# EAGLE board leitorcartao (EAGLE 6.3)
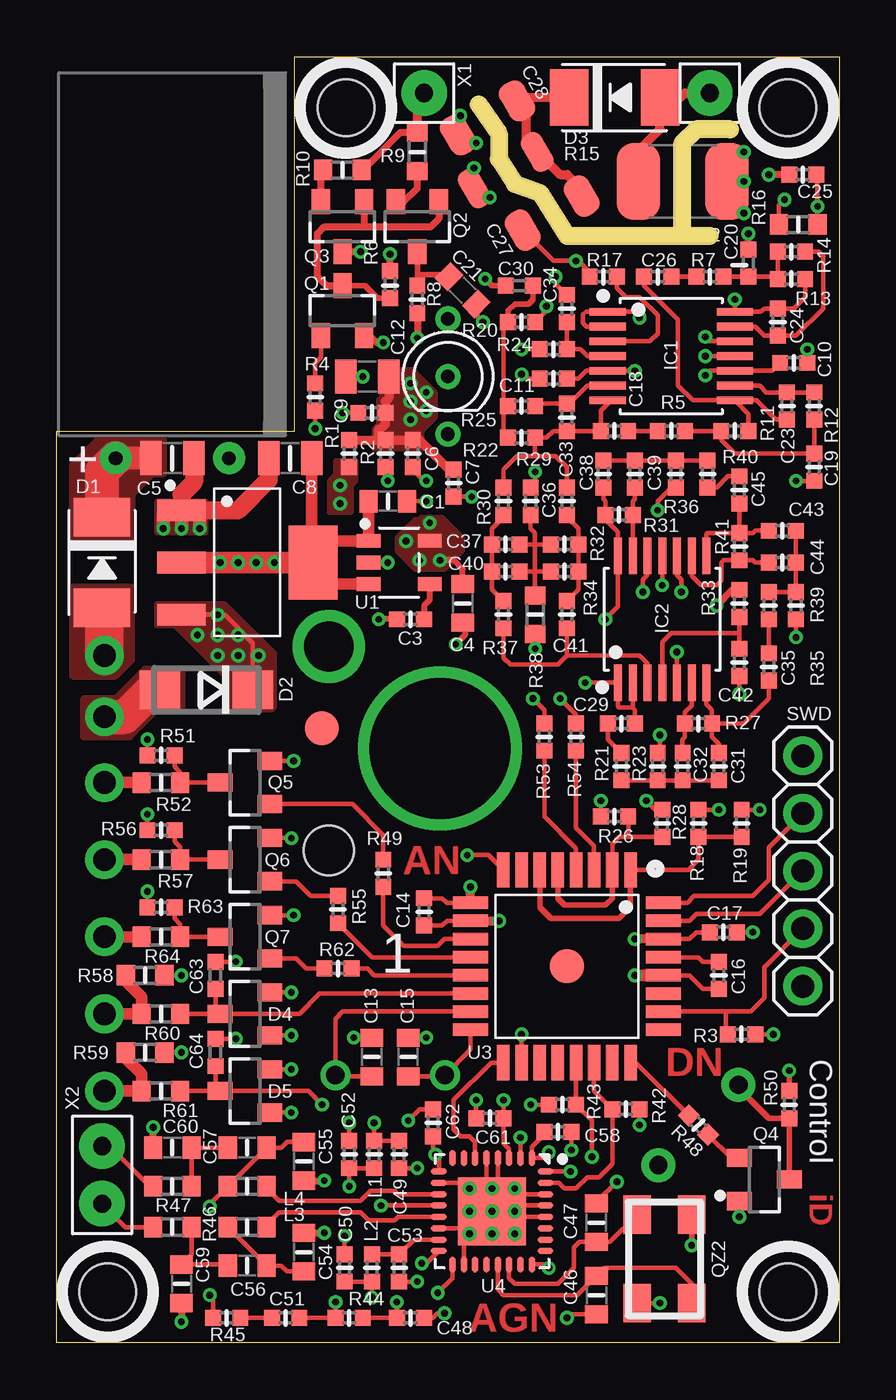
[diagram p5: board, top side]
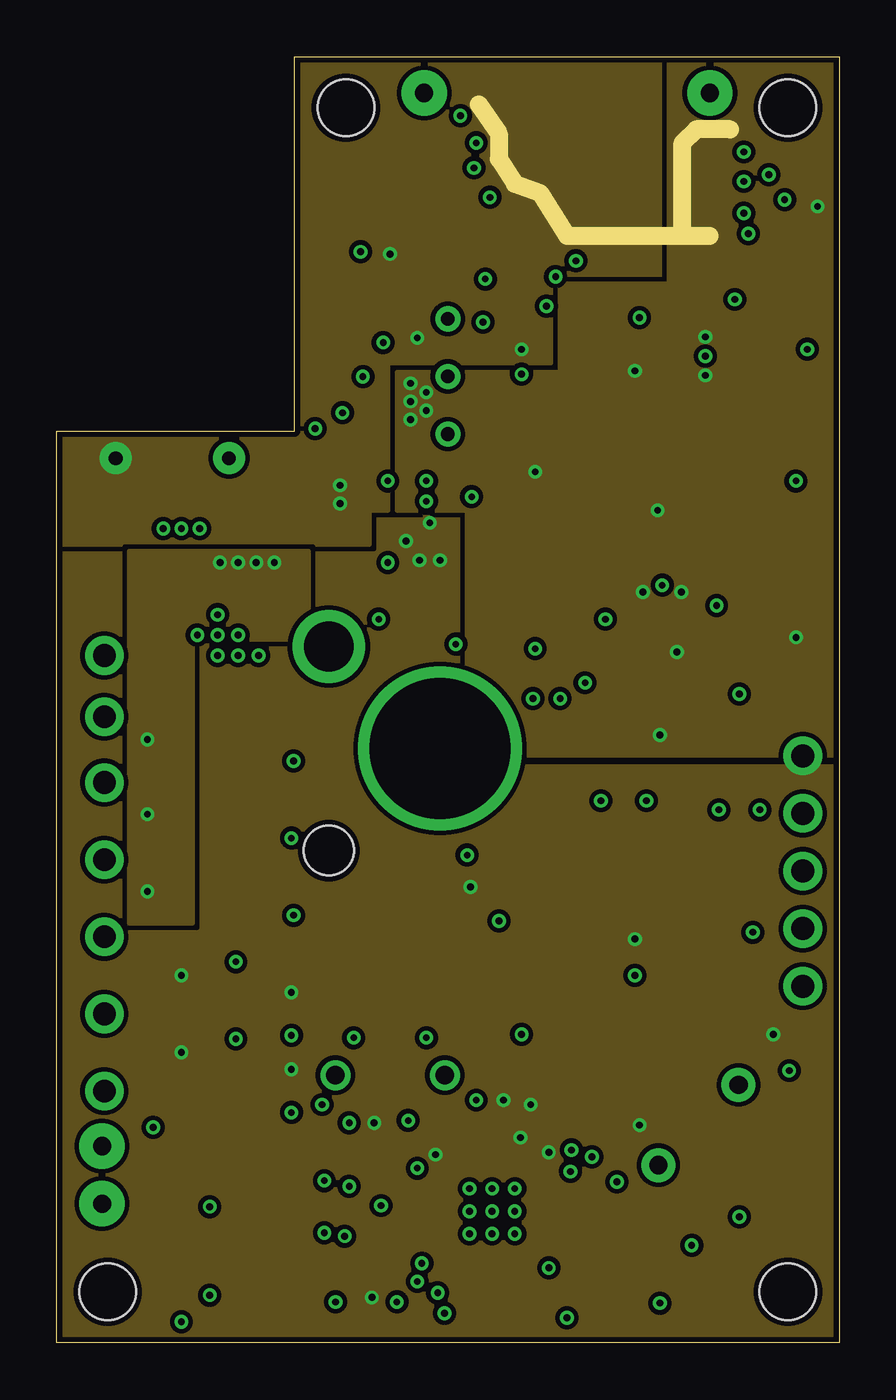
[diagram p6: board, inner layer Route4]
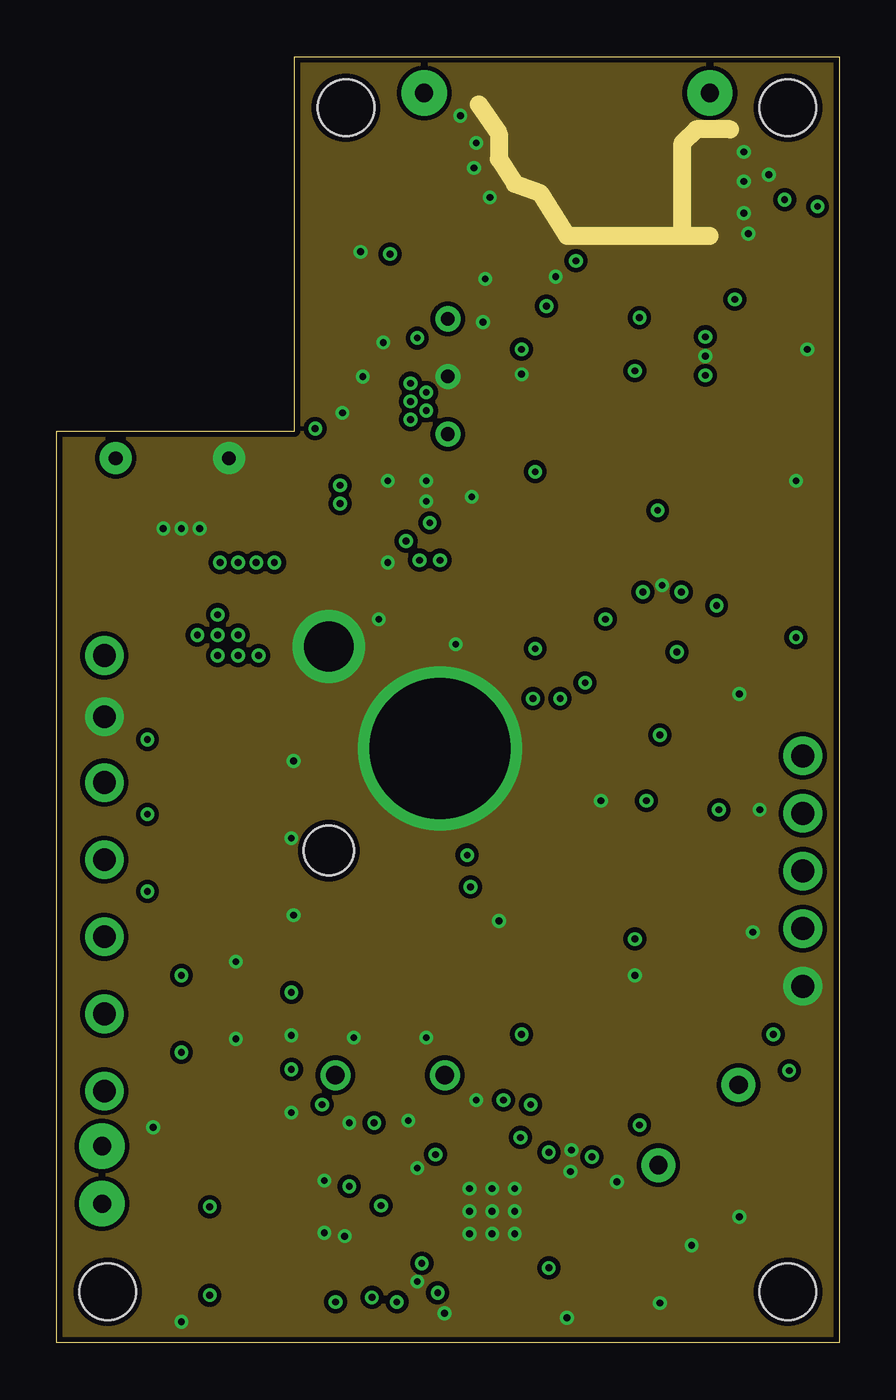
[diagram p7: board, inner layer Route5]
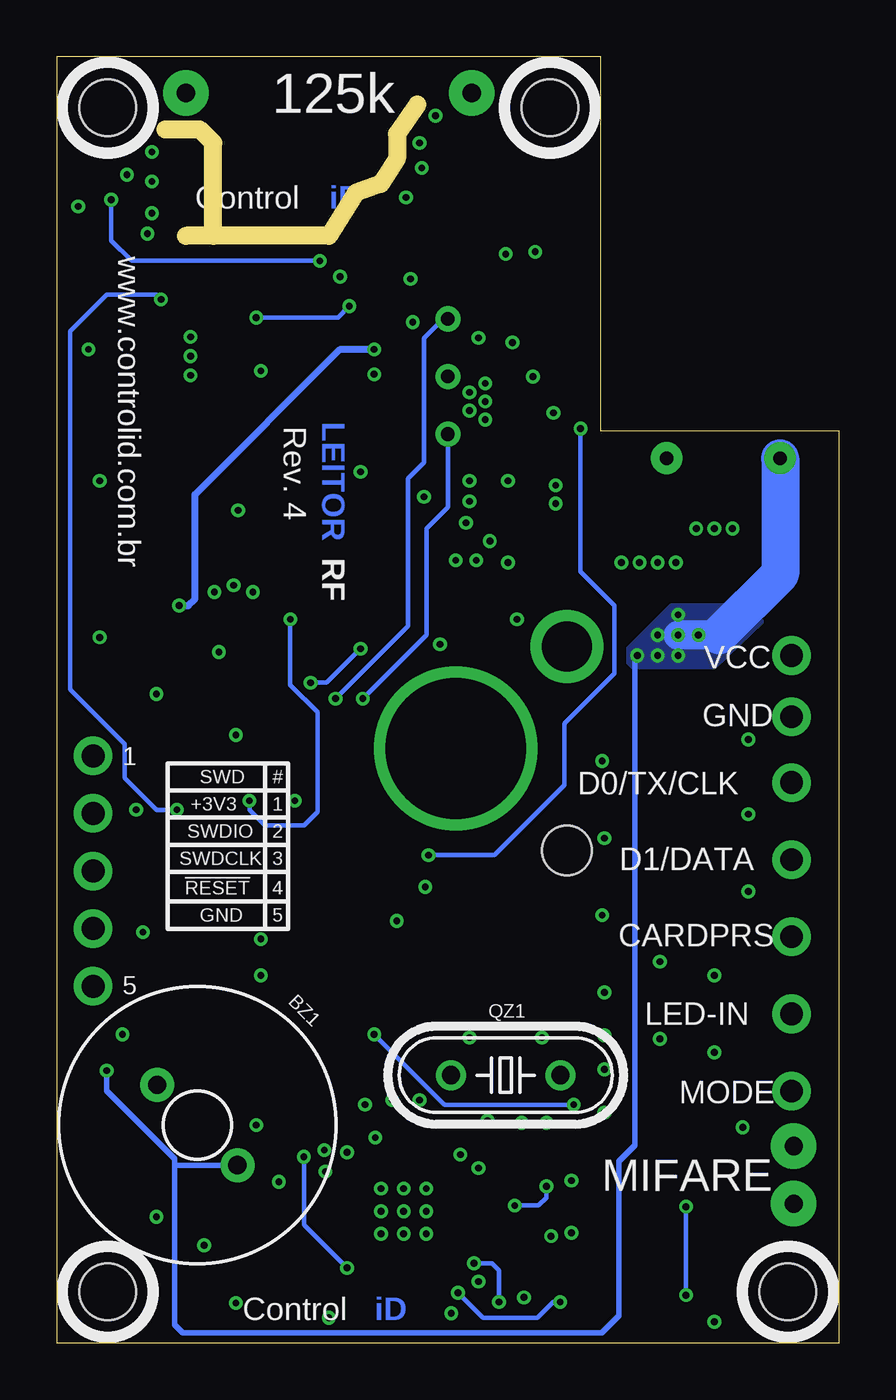
[diagram p8: board, bottom side, seen from below]

Size 34.5 x 56.7 mm. Coordinates in mm from the lower left corner, seen from the top.
Outline: 10.5,56.7 34.5,56.7 34.5,0 0,0 0,40.2 10.5,40.2 10.5,56.7
Copper layers (1+4*5+16): Top 0.035mm / dielectric 0.2mm / Route4 0.035mm / dielectric 1.1mm / Route5 0.035mm / dielectric 0.2mm / Bottom 0.035mm
Design rules "LeitorDRC": minimum track width 8mil, minimum drill 0.3mm, track to track 8mil, track to pad 8mil, pad to pad 8mil, via to via 8mil, smd to smd 0mil, copper to edge 10mil, drill to drill 10mil, minimum pad ring 10mil, minimum via ring 6mil, stop-mask expansion 2mil, vias tented up to drill 100mil, thermal gap 10mil
Holes 2.2 mm at 12,21.7
Holes 2.5 mm at 2.25,2.25 32.25,2.25 12.75,54.45 32.25,54.45
bRestrict: area 17.9,53.9 to 18.2,56.5; area 29.9,32.2 to 34.4,32.4
Milling: 10 lines

## Footprints (pad centres in the part's own frame; a part is rotated, then mirrored left to right if it is on the bottom)
F/TMB = drill 0.8 pad 1.5: + 2.5,0; - -2.5,0
C0603 = smd 0.8 x 1: 1 -0.85,0; 2 0.85,0
ESK108M016AH2AA = drill 0.6 pad 1.4: + -2.5,0; - 2.5,0
C0402 = smd 0.7 x 0.7: 1 -0.6,0; 2 0.6,0
C0805 = smd 0.95 x 1.5: 1 -0.95,0; 2 0.95,0
C1812S = smd 1.9 x 3.4: 1 -1.95,0; 2 1.95,0
C1206S = smd 1.2 x 1.8: 1 -1.5,0; 2 1.5,0
HOLE = drill 1 pad 1.7: P$1 0,0
SMA = smd 1.7 x 2.5: A 2,0; K -2,0
DO214AC = smd 1.8 x 1.7: A 2.05,0; C -2.05,0
SOT23 = smd 0.8 x 1.1: 1 -0.95,-1.1; 2 0.95,-1.1; 3 0,1.1
FIDUCIAL-1.5X3 = smd 1.5 x 1.5: 1 0,0
TSSOP14 = smd 0.35 x 1.6: 1 -1.95,-2.8; 2 -1.3,-2.8; 3 -0.65,-2.8; 4 0,-2.8; 5 0.65,-2.8; 6 1.3,-2.8; 7 1.95,-2.8; 8 1.95,2.8; 9 1.3,2.8; 10 0.65,2.8; 11 0,2.8; 12 -0.65,2.8; 13 -1.3,2.8; 14 -1.95,2.8
R0402 = smd 0.7 x 0.7: 1 -0.6,0; 2 0.6,0
R0603 = smd 0.8 x 0.9: 1 -0.85,0; 2 0.85,0
LTL1BEKVJNN = drill 0.6: ANODE_GRN -2.54,0; ANODE_RED 2.54,0; COMMON 0,0
HC49/S = drill 0.813: 1 -2.413,0; 2 2.413,0
CRISTAL4SMD = smd 1.7 x 1.2: 1 -1.95,-1.2; 2 1.95,-1.2; 3 1.95,1.2; 4 -1.95,1.2
R1206S = smd 1 x 1.8: 1 -1.6,0; 2 1.6,0
1X05 = drill 1.016 pad 1.7: 1 -5.08,0; 2 -2.54,0; 3 0,0; 4 2.54,0; 5 5.08,0
SOT-23-5 = smd 0.6 x 1.05: 1 -0.95,-1.35; 2 0,-1.35; 3 0.95,-1.35; 4 0.95,1.35; 5 -0.95,1.35
SOT223-3L = smd 0.95 x 2.15: 1 -2.3,-2.9; 2 0,-2.9; 3 2.3,-2.9 | smd 3.25 x 2.15: 4 0,2.9
TQFP32 = smd 0.55 x 1.55: 1 -2.8,-4.25; 2 -2,-4.25; 3 -1.2,-4.25; 4 -0.4,-4.25; 5 0.4,-4.25; 6 1.2,-4.25; 7 2,-4.25; 8 2.8,-4.25; 17 2.8,4.25; 18 2,4.25; 19 1.2,4.25; 20 0.4,4.25; 21 -0.4,4.25; 22 -1.2,4.25; 23 -2,4.25; 24 -2.8,4.25 | smd 1.55 x 0.55: 9 4.25,-2.8; 10 4.25,-2; 11 4.25,-1.2; 12 4.25,-0.4; 13 4.25,0.4; 14 4.25,1.2; 15 4.25,2; 16 4.25,2.8; 25 -4.25,2.8; 26 -4.25,2; 27 -4.25,1.2; 28 -4.25,0.4; 29 -4.25,-0.4; 30 -4.25,-1.2; 31 -4.25,-2; 32 -4.25,-2.8
QFN32 = smd 0.69 x 0.28: 1 -2.35,1.75; 2 -2.35,1.25; 3 -2.35,0.75; 4 -2.35,0.25; 5 -2.35,-0.25; 6 -2.35,-0.75; 7 -2.35,-1.25; 8 -2.35,-1.75; 17 2.35,-1.75; 18 2.35,-1.25; 19 2.35,-0.75; 20 2.35,-0.25; 21 2.35,0.25; 22 2.35,0.75; 23 2.35,1.25; 24 2.35,1.75 | smd 0.28 x 0.69: 9 -1.75,-2.35; 10 -1.25,-2.35; 11 -0.75,-2.35; 12 -0.25,-2.35; 13 0.25,-2.35; 14 0.75,-2.35; 15 1.25,-2.35; 16 1.75,-2.35; 25 1.75,2.35; 26 1.25,2.35; 27 0.75,2.35; 28 0.25,2.35; 29 -0.25,2.35; 30 -0.75,2.35; 31 -1.25,2.35; 32 -1.75,2.35 | smd 3 x 3: 33 0,0
22-23-2021 = drill 0.8 pad 2: 1 -6.3,0; 2 6.3,0
ANTENNA = drill 0.8 pad 2: 1 -1.27,0; 2 1.27,0

## Placement (x,y rotation side)
BZ1  F/TMB  [F/TMB]  28.3,9.6 315 bottom
C1  4.7u  [C0603]  14.6,37.1 0 top
C2  ESK108M016AH2AA  [ESK108M016AH2AA]  5.1,39 0 top
C3  10n  [C0402]  15.6,31.9 180 top
C4  4.7u  [C0603]  17.9,32.6 270 top
C5  10u  [C0805]  5.1,39 0 top
C6  0.1u  [C0402]  15.7,39.2 270 top
C7  10n  [C0402]  17.5,37.9 270 top
C8  10u  [C0805]  10.3,39 180 top
C9  0.1u  [C0402]  13.9,41 180 top
C10  0.1u  [C0402]  32.5,43.2 0 top
C11  0.1u  [C0402]  21.9,42.5 180 top
C12  10u  [C0805]  13.7,42.6 180 top
C13  18p  [C0603]  13.9,12.6 90 top
C14  0.1u  [C0402]  16.2,19 270 top
C15  18p  [C0603]  15.5,12.6 90 top
C16  0.1u  [C0402]  29.2,16.2 270 top
C17  0.1u  [C0402]  29.4,18.1 0 top
C18  220n  [C0402]  24.6,40.2 180 top
C19  4.7n  [C0402]  33.4,38.6 270 top
C20  4.7n  [C0402]  30.5,47.6 90 top
C21  DNP  [C0603]  17.9,46.4 315 top
C22  1n  [C1812S]  27.6,51.2 0 top
C23  68p  [C0402]  32.2,41.3 90 top
C24  68p  [C0402]  31.8,45 90 top
C25  0.1u  [C0402]  32.9,51.5 180 top
C26  220n  [C0402]  26.5,47 0 top
C27  220n  [C1206S]  21.85,49.8 210 top
C28  1n  [C1206S]  19,54 210 top
C29  F:0.1uP:10n  [C0402]  24.9,27.3 0 top
C30  680p  [C0402]  20.4,46.6 180 top
C31  F:220pP:68p  [C0402]  29.2,25.4 270 top
C32  F:1nP:100p  [C0402]  27.6,25.4 270 top
C33  68p  [C0402]  22.5,40.8 90 top
C34  0.1u  [C0402]  22.5,45.6 90 top
C35  F:0.1uP:10n  [C0402]  31.4,29.8 90 top
C36  47p  [C0402]  22.5,37.1 90 top
C37  47p  [C0402]  19.8,35.2 0 top
C38  F:220pP:68p  [C0402]  24.1,38.3 90 top
C39  F:1nP:100p  [C0402]  25.5,38.3 90 top
C40  47p  [C0402]  19.8,34 0 top
C41  47p  [C0402]  22.5,32.1 90 top
C42  0.1u  [C0402]  30.1,30 270 top
C43  F:220pP:68p  [C0402]  32,35.8 0 top
C44  F:1nP:100p  [C0402]  32,34.4 0 top
C45  F:0.1uP:10n  [C0402]  30.1,37.6 270 top
C46  18p  [C0603]  23.8,2.1 270 top
C47  18p  [C0603]  23.8,5.3 90 top
C48  0.1u  [C0402]  15.6,1.1 0 top
C49  100p  [C0402]  15.1,8.3 270 top
C50  100p  [C0402]  12.7,3.3 90 top
C51  1n  [C0402]  10.1,1.1 0 top
C52  0.1u  [C0402]  12.9,8.3 90 top
C53  0.1u  [C0402]  15.1,3.3 270 top
C54  120p  [C0603]  10.9,4 90 top
C55  120p  [C0603]  10.9,8 90 top
C56  18p  [C0603]  8.4,3.4 0 top
C57  18p  [C0603]  8.4,8.6 0 top
C58  0.1u  [C0402]  22.1,9.3 0 top
C59  56p  [C0603]  5.5,2.6 270 top
C60  56p  [C0603]  5.1,8.6 0 top
C61  0.1u  [C0402]  19.1,9.9 180 top
C62  0.1u  [C0402]  16.6,9.7 90 top
C63  0.1u  [C0402]  7,16.2 90 top
C64  0.1u  [C0402]  7,12.8 90 top
CARDPRS  CARD-PRES  [HOLE]  2.1,17.9 0 top
D0/TX/CLK  D0/CLK/TX  [HOLE]  2.1,24.7 0 top
D1  BYG20J  [SMA]  2,34.4 270 top
D1/DATA  D1/DATA  [HOLE]  2.1,21.3 0 top
D2  [DO214AC]  6.6,28.8 180 top
D3  BYG20J  [SMA]  24.6,54.9 0 top
D4  BAT54S  [SOT23]  8.3,14.5 90 top
D5  BAT54S  [SOT23]  8.3,11.1 90 top
FID1  FIDUCIAL1.5X3  [FIDUCIAL-1.5X3]  11.7,27.1 0 top
FID3  FIDUCIAL1.5X3  [FIDUCIAL-1.5X3]  22.5,16.6 0 top
GND  GND  [HOLE]  2.1,27.6 0 top
IC1  TL084  [TSSOP14]  27.1,43.5 270 top
IC2  TL084  [TSSOP14]  26.7,31.9 0 top
L1  22n  [R0402]  14,8.3 270 top
L2  22n  [R0402]  13.9,3.3 90 top
L3  1u  [R0603]  8.4,5.1 180 top
L4  1u  [R0603]  8.4,6.9 180 top
LED1  LTL1BEKVJNN  [LTL1BEKVJNN]  17.25,42.6 270 top
LED-IN  LED  [HOLE]  2.1,14.5 0 top
MODE  MODESELECT  [HOLE]  2.1,11.1 0 top
Q1  DMN3404  [SOT23]  12.6,45.5 0 top
Q2  MMBT4401  [SOT23]  15.9,49.2 180 top
Q3  MMBT4403  [SOT23]  12.6,49.2 180 top
Q4  MMBT4401  [SOT23]  31.2,7.2 270 top
Q5  MMBT4401  [SOT23]  8.3,24.7 90 top
Q6  MMBT4401  [SOT23]  8.3,21.3 90 top
Q7  MMBT4401  [SOT23]  8.3,17.9 90 top
QZ1  8MHz  [HC49/S]  14.7,11.8 180 bottom
QZ2  27.12MHz  [CRISTAL4SMD]  26.8,3.7 270 top
R1  470  [R0402]  12.9,39.2 90 top
R2  470  [R0402]  14.5,39.2 90 top
R3  12k  [R0402]  30.2,13.6 0 top
R4  1k  [R0402]  11.4,41.7 90 top
R5  4.7k  [R0402]  27.1,40.2 180 top
R6  2.2k  [R0402]  14.7,46.65 90 top
R7  4.7k  [R0402]  28.8,47 0 top
R8  0  [R0402]  15.9,46 270 top
R9  10  [R0603]  15.9,52.5 270 top
R10  10  [R0603]  12.6,51.7 0 top
R11  91k  [R0402]  29.9,40.2 180 top
R12  13k  [R0402]  33.4,41.3 270 top
R13  91k  [R0402]  32.4,46.9 0 top
R14  13k  [R0402]  32.4,48.1 180 top
R15  1M  [R1206S]  19.8,51.7 30 top
R16  100k  [R0603]  32.7,49.3 0 top
R17  1k  [R0402]  24.1,47 180 top
R18  27k  [R0402]  28.3,22.9 270 top
R19  9.1k  [R0402]  30.2,22.9 270 top
R20  9.1k  [R0402]  20.5,45 180 top
R21  F:5.1kP:5.6k  [R0402]  24.9,25.4 270 top
R22  9.1k  [R0402]  20.5,39.9 180 top
R23  F:7.5kP:5.1k  [R0402]  26.5,25.4 270 top
R24  0  [R0402]  21.9,43.8 0 top
R25  13k  [R0402]  20.5,41.3 0 top
R26  9.1k  [R0402]  24.6,23.2 0 top
R27  F:180kP:270k  [R0402]  28.3,27.3 0 top
R28  27k  [R0402]  26.7,22.9 270 top
R29  470  [R0402]  20.9,37.1 90 top
R30  27k  [R0402]  19.7,37.1 270 top
R31  F:180kP:270k  [R0402]  24.8,36.5 0 top
R32  27k  [R0402]  22.4,35.2 180 top
R33  0  [R0402]  30.1,32.6 270 top
R34  27k  [R0402]  22.4,34 180 top
R35  F:5.1kP:5.6k  [R0402]  31.4,32.5 270 top
R36  F:7.5kP:5.1k  [R0402]  27.3,38.3 90 top
R37  27k  [R0402]  19.7,32.1 270 top
R38  100  [R0603]  21.1,32.1 90 top
R39  F:7.5kP:5.1k  [R0402]  32.6,32.5 90 top
R40  F:5.1kP:5.6k  [R0402]  28.7,38.3 90 top
R41  F:180kP:270k  [R0402]  30.1,35.1 270 top
R42  4.7k  [R0402]  25.1,10.3 0 top
R43  4.7k  [R0402]  22.3,10.5 180 top
R44  1k  [R0402]  12.9,1.1 0 top
R45  2.2k  [R0402]  7.5,1.1 0 top
R46  3.3  [R0603]  5.1,5.1 180 top
R47  3.3  [R0603]  5.1,6.9 180 top
R48  2.2k  [R0402]  28.3,9.6 135 top
R49  2.2k  [R0402]  14.4,20.7 270 top
R50  1k  [R0402]  32.3,10.5 90 top
R51  1k  [R0402]  4.6,25.9 180 top
R52  100  [R0603]  4.6,24.7 0 top
R53  130  [R0402]  21.5,26.7 90 top
R54  120  [R0402]  22.9,26.7 270 top
R55  2.2k  [R0402]  12.4,19.1 270 top
R56  1k  [R0402]  4.6,22.6 180 top
R57  100  [R0603]  4.6,21.3 0 top
R58  100k  [R0603]  3.9,16.2 180 top
R59  100k  [R0603]  3.9,12.8 180 top
R60  100k  [R0603]  4.6,14.5 180 top
R61  100k  [R0603]  4.6,11.1 180 top
R62  2.2k  [R0402]  12.4,16.5 0 top
R63  1k  [R0402]  4.6,19.2 180 top
R64  100  [R0603]  4.6,17.9 0 top
SWD  [1X05]  32.9,20.8 270 top
U1  TLV71333PDBVR  [SOT-23-5]  15.1,34.4 270 top
U2  NCP1117LPST50T3G  [SOT223-3L]  8.4,34.4 270 top
U3  SAMD20E14A-AUT  [TQFP32]  22.5,16.6 180 top
U4  MFRC52202HN1  [QFN32]  19.2,5.8 270 top
VCC  VCC  [HOLE]  2.1,30.3 0 top
X1  ANTENA  [22-23-2021]  22.5,55.1 0 top
X2  MIFARE  [ANTENNA]  2,7.4 90 top

## Tracks (layer width: path | path; a pad name or v marks a point on that pad's centre or on a via)
125KHZ  (via drill 0.3)
  Top 0.203: U3.8 19.05,21.5 v18.1,21.5 | v11.4,40.3 R4.1
  Bottom 0.203: v18.1,21.5 15.2,21.5 12.1,24.6 12.1,27.3 9.9,29.5 9.9,32.5 11.4,34 v11.4,40.3
+3V3  (via drill 0.3)
  Top 0.203: C50.1 L2.1 v13.9,2 | C49.1 L1.1 v14,9.7 | R43.2 v20.9,10.5 | U3.30 27.9,17.8 28.2,18.1 C17.1 | R3.2 v31.6,13.6 | C58.1 21.5,9.2 20.95,8.65 U4.1 21.45,8.15 v21.7,8.4 | U4.3 19.95,8.55 19.7,8.8 C61.1 v19.7,10.7 | U4.2 v20.45,9.05 | R58.1 v5.5,16.2 | D4.2 v10.35,15.45 | D5.2 v10.35,12.05 | R59.1 v5.5,12.8 | U3.9 17.2,19.4 17,19.6 C14.1 | R42.2 v25.7,9.6 | U4.9 16.85,8.15 v16.7,8.3 16.6,8.4 C62.1
  Top 0.254: C4.1 17.9,34.1 17.5,34.5 v16.9,34.5
  Top 0.4: U3.30 v25.5,17.8 | U3.9 v18.25,20.1
  other vias: 16.45,36.15 16,34.5 15.4,35.35
  pour Route4 (isolate 0.127, rank 3, no thermals): 0,0 34.5,0 34.5,25.4 17.8,25.4 17.8,36.4 14.1,36.4 14.1,35 0,35
  pour Top (no thermals): 15,35.5 15,34.9 15.8,34.1 17.1,34.1 17.9,34.9 17.9,35.5 17,36.4 15.9,36.4
+5V  (via drill 0.3)
  Top 0.203: R56.2 v4,23.3 | R63.2 v4,19.9 | R51.2 v4,26.6
  Top 0.4: 11.25,34.45 U2.4
  Top 0.5: U1.3 12.25,33.45 U2.4 12.25,35.35 U1.1 C1.1 | C8.1 11.25,34.45
  Top 0.95: U2.2 v7.2,34.4 v8,34.4 v8.8,34.4 v9.6,34.4 U2.4
  pour Route4: 6,18.5 3.2,18.5 3.2,34.9 11.1,34.9 11.1,31 6,31
+12V  (via drill 0.3)
  Top 0.203: R24.1 v20.5,43.8 | 6,32.1 v7.1,32.1 7.4,32.1 8.65,30.85 D2.C
  Top 0.25: v32.3,12 R50.2
  Top 0.3: R6.2 v14.7,48 | R8.2 v15.9,44.3 | R33.1 29.8,33.2 v29.1,32.5
  Top 0.6: 5.3,32.1 6,32.1
  Top 0.8: 6,32.1 U2.3
  Top 1: C2.+ C5.1
  Top 1.5: D1.K 2,38.4 C2.+
  Bottom 0.25: 29.3,7.9 29.3,0.8 28.95,0.45 10.45,0.45 9.7,1.2 9.7,8 9,8.7 9,30.2 v8.9,30.3 | 29.3,7.9 29.3,8.1 R50.2 v32.3,12 | BZ1.+ 29.23,7.83 29.3,7.9
  Bottom 0.3: v29.1,32.5 28.7,32.5 28.4,32.8 28.4,37.4 22,43.8 v20.5,43.8
  Bottom 1.27: 5.3,31.2 v7.1,31.2
  Bottom 1.676: C2.+ 2.6,33.9 5.3,31.2
  other vias: 12.5,37.8 12.5,37 8,31.2 8,30.3 7.1,30.3 6.2,31.2
  pour Route4 (isolate 0.127, rank 2, no thermals): 0,40.2 0,35.2 13.8,35.2 13.8,36.7 14.6,36.7 14.6,43.2 21.8,43.2 21.8,46.8 26.9,46.8 26.9,56.7 10.5,56.7 10.5,40.2
  pour Top (no thermals): 12,36.6 12,38 12.3,38.3 12.3,38.9 13.2,38.9 13.2,38 13,37.8 13,36.6
  pour Top (isolate 0.203, no thermals): 0.7,35.6 0.7,38.7 1.8,39.8 4.7,39.8 4.7,38.3 4.2,38.3 3.3,37.4 3.3,35.5 0.7,35.5
  pour Bottom: 4.7,32.5 7.4,32.5 9.3,30.6 9.3,30 9.1,29.8 5.5,29.8 3.4,31.8
  pour Top (no thermals): 4.4,32.6 4.4,31.6 5.2,31.6 7.7,29.1 7.7,28 7.8,27.9 9.5,27.9 9.6,28 9.6,30.4 7.4,32.6
ASK
  Top 0.203: R19.2 R18.2 28.3,21.3 27.85,20.85 U3.1
  Top 0.25: U3.1 25.3,19.2 24.8,18.7 21.8,18.7 21.3,19.2 U3.6
ASK-OUT
  Top 0.203: IC1.7 24.3,41.4 24,41.1 C18.2 C33.1 21.9,40.2 21.6,39.9 R22.1 21.1,39.1 | 21.1,39.1 22,39.1 22.5,38.6 C36.2 | 21.1,39.1 20.3,39.1 19.7,38.5 R30.1
ASK_MID
  Top 0.203: R7.1 C26.2
BUZZER
  Top 0.203: 25.37,12.42 U3.24 25.55,12.35 R48.2
CARD-PRES
  Top 0.203: U3.13 14,16.2 13.7,16.5 R62.2
D0/TX/CLK
  Top 0.203: U3.11 17.1,17.8 16.8,17.5 15.3,17.5 14.4,18.4 R49.2
D1/DATA
  Top 0.203: U3.12 13.9,17 R55.2
FSK-PSK
  Top 0.203: U3.2 24.5,22 24.8,22.3 25.2,22.3 | R28.2 25.2,22.3 | R26.2 25.2,22.3
  Top 0.25: U3.2 24.5,19.6 24.2,19.3 22.4,19.3 22.1,19.6 U3.5
FSK/PSK  (via drill 0.3)
  Top 0.203: C29.2 25.5,27.9 25.4,28 | 25.4,28 IC2.2 | R38.1 v21.1,30.6 | v23.3,29.1 IC2.1 24.75,28.05 24.8,28 25.4,28
  Bottom 0.203: v21.1,30.6 22.6,29.1 v23.3,29.1
GND  (via drill 0.3, 2.2 pad 2, 6.2)
  Top 0.203: U4.32 v22.65,7.55 | D4.1 v10.35,13.55 | D5.1 v10.35,10.15 | Q7.2 v10.45,18.85 | Q6.2 v10.35,22.25 | Q5.2 v10.45,25.65 | C34.2 22,46.7 v22,47 | C50.2 v12.7,4.7 | C53.2 v15.9,2.7 | C49.2 v15.9,7.7 | C52.2 v12.9,9.7 | C48.2 16.6,1.1 16.8,1.3 v17.1,1.3 | U4.14 17.95,5.05 v18.2,4.8 17.95,4.55 U4.18 | U4.28 20.45,5.55 v20.2,5.8 20.45,6.05 U4.29 | U4.5 18.95,7.05 v19.2,6.8 19.45,7.05 U4.4 | U4.10 17.95,7.05 v18.2,6.8 | U4.30 20.45,6.55 v20.2,6.8 | C42.2 v30.1,28.6 | C11.2 20.7,42.5 v20.5,42.7 | C10.2 v33.1,43.8 | C17.2 v30.7,18.1 | C58.2 v22.7,8.5 | C61.2 v18.5,10.7 | IC1.11 v28.6,43.5 | C19.2 v32.6,38 | C12.2 v13.5,42.6 | C9.2 v12.6,41 | C1.2 v16.3,37.1 | C7.2 v18.3,37.3 | C6.2 15.7,38.5 16.2,38 v16.3,38 | 14.6,38.4 v14.6,38 | C16.2 28.5,15.6 27.9,16.2 U3.28 | U3.10 17.2,18.6 17,18.4 C14.2 | IC2.11 v26.7,33.4 | R26.1 v24,23.9 | R19.1 v31,23.5 | C62.2 16,10.3 v15.5,9.8 | C63.2 v7.9,16.8 | C64.2 v7.9,13.4 | C13.2 v13.1,13.45 | C15.2 v16.3,13.45 | C47.2 23.85,6.25 v24.7,7.1 | C46.2 22.65,1.25 v22.5,1.1 | QZ2.2 v26.6,1.75 | v17.8,54.1 17.65,53.45 C28.2 17.95,53.15 v18.5,52.9 | v18.4,51.8 18.41,51.71 R15.1 18.81,50.5 v19.1,50.5 | C22.2 v30.3,51.2 | v30.3,52.5 30.3,52.15 C22.2 | v30.3,49.8 30.3,50.25 C22.2
  Top 0.25: QZ2.4 v28,4.3 | C21.2 18.5,45.3 v18.8,45 | C30.2 19.2,46.6 v18.9,46.9
  Top 0.254: C3.2 v14.2,31.9 | 18,31.6 18,31.2 v17.6,30.8
  Top 0.3: Q3.3 v13.4,48.1 | Q1.2 13.8,44.4 14.1,44.1 v14.4,44.1 | C20.2 v30.5,48.9 | C60.1 v4.25,9.5 | C59.2 v5.5,0.93 | C55.1 v11.8,7.15 | C54.2 v11.8,4.85 | U1.2 v14.6,34.4 | U2.1 4.9,36.7 4.7,36.5 | C25.2 v31.4,51.5
  Top 0.4: Q4.2 v30.1,5.55 | U3.10 v19.5,18.6
  Top 0.406: 18,31.6 17.9,31.6 C4.2 | R2.1 14.6,38.6 v14.6,38
  Top 0.5: U3.28 v25.5,16.2
  Top 0.6: U2.1 v5.5,35.9 | 4.7,36.5 v4.7,35.9 | 6.3,36.7 v6.3,35.9
  Top 0.8: C5.2 6.05,37.95 5.5,37.4 U2.1 6.3,36.7 8,36.7 9.35,38.05 C8.2
  Top 1: D2.A 4.2,28.8
  Top 1.5: GND.P$1 3,27.6 4.2,28.8
  other vias: 16.9,26.2 12,30.7 19.2,5.8 18.2,5.8 19.2,4.8 20.2,4.8
  pour Route5 (no thermals): 0,0 34.5,0 34.5,56.7 10.5,56.7 10.5,40.2 0,40.2 0,39.5
  pour Top (isolate 0.203, rank 2, no thermals): 5.5,29.7 5.5,28 4.5,28 3.2,26.7 1.2,26.7 1.2,28.4 2.6,28.4 3.9,29.7
  pour Top (no thermals): 4.4,37.1 4.4,35.7 6.6,35.7 6.6,37.1
LED-GRN-CTRL
  Top 0.203: U3.4 22.9,21.8 21.5,23.2 R53.1
LED-INPUT
  Top 0.203: R60.1 D4.3 | U3.14 11.6,15.4 10.7,14.5 D4.3 | D4.3 7,14.7 C63.1
LED-RED-CTRL
  Top 0.203: U3.3 23.7,21.9 22.9,22.7 R54.2
MIFARE-RST
  Top 0.203: U3.17 19.15,12.35 17.5,10.7 17.5,9.4 17.8,9.1 18.2,9.1 18.45,8.85 U4.6
MIFARE-RX  (via drill 0.3)
  Top 0.203: C51.2 R44.1 v12.3,1.8 | v16.8,2.2 17.45,2.85 U4.17
  Bottom 0.203: v12.3,1.8 12.6,1.8 13.3,1.1 15.7,1.1 v16.8,2.2
MIFARE-SCL
  Top 0.203: U4.31 22.15,7.05 22.4,6.8 22.9,6.8 23.4,7.3 23.9,7.3 24.5,7.9 R42.1 23.7,11.1 U3.22
MIFARE-SDA  (via drill 0.3)
  Top 0.203: U4.24 21.55,3.45 v21.7,3.3 | v23.6,8.2 23.6,9.8 R43.1 U3.21
  Bottom 0.203: v23.6,8.2 23.6,5.2 v21.7,3.3
MIFARE-TX1
  Top 0.203: 9.25,6.75 L4.1 9.25,6.8 9.8,6.25 13.4,6.25 13.85,6.7 14.9,6.7 15.05,6.55 U4.11
MIFARE-TX2
  Top 0.203: 9.25,5.25 L3.1 9.25,5.2 9.8,5.75 13.4,5.75 13.75,5.4 14.9,5.4 15.05,5.55 U4.13
N$2  (via drill 0.3)
  Top 0.203: L1.2 C52.1 v12.9,6.9 | U4.12 v14.3,6.05
  Bottom 0.203: v14.3,6.05 13.25,6.05 12.9,6.4 v12.9,6.9
N$3
  Top 0.203: U4.21 19.45,2.35 19.7,2.1 22.95,2.1 C46.1 24.15,3.3 27.3,3.3 28,2.6 QZ2.3
N$4
  Top 0.203: L2.2 C53.1 15.75,4.55 U4.15
N$5
  Top 0.203: U4.22 19.95,2.85 20.2,2.6 22.1,2.6 22.8,3.3 22.8,4.2 23.05,4.45 C47.1 | 23.55,4.55 C47.1 | C47.1 24.4,4.45 QZ2.1
N$6
  Top 0.203: Q6.1 10.55,20.35 11.2,19.7 R55.1
N$7
  Top 0.25: Q1.3 13.6,46.6 14.15,46.05 R6.1
  Top 0.3: Q1.3 11.9,46.6 11.5,47 11.5,48.9 11.8,49.2 13.5,49.2 | 13.5,49.2 16.5,49.2 16.85,49.55 Q2.1 | Q3.1 13.55,49.25 13.5,49.2
N$8
  Top 0.203: R4.2 11.4,43.2 11.65,43.45 Q1.1
N$9
  Top 0.203: 25.85,52.75 25.85,51.4 C22.1
  Top 0.4: X1.2 27.7,55.1 27.5,54.9 D3.A 26.6,53.5 25.85,52.75
N$10  (via drill 0.3)
  Top 0.203: v25.7,45.2 25.45,45.45 IC1.1 23.35,45.45 23.2,45.35 23.2,44.95 23.35,44.8 IC1.2 | v21.6,45.7 21.6,45.5 R20.1
  Bottom 0.203: v25.7,45.2 22.1,45.2 v21.6,45.7
N$11
  Top 0.3: R10.2 13.5,51.7 15.15,53.35 R9.1
  Top 0.4: R9.1 15.9,54.8 X1.1
N$12
  Top 0.203: R20.2 19.9,44.9 19.7,44.7 19.7,41.5 R25.1 19.9,41.2 19.7,41 19.7,40.1 R22.2
  Top 0.25: R20.2 19.9,45.5 20.2,45.8 20.8,45.8 21,46 C30.1
N$13
  Top 0.4: D3.K 20.45,54.9 C28.1 20.7,54.35 20.7,52.99 R15.2 22.19,51.5 22.5,51.5 23.15,50.85 C27.1
N$14  (via drill 0.3)
  Top 0.203: C27.2 21.9,47.7 v22.9,47.7 23,47.7 23.5,47.2 R17.2 | v32.1,50.4 31.85,50.15 R16.1
  Bottom 0.203: v22.9,47.7 31.2,47.7 32.1,48.6 v32.1,50.4
N$15
  Top 0.203: IC1.6 23.45,42.2 arc45 23.36,42.16 22.6,41.4 C33.2 | 22.4,41.3 C33.2 | C33.2 21.2,41.4 arc90 R25.2
N$16
  Top 0.3: Q2.2 15.3,50.3 15.9,50.9 R9.2
N$17
  Top 0.203: R29.1 20.9,35.9 21.1,35.7 21.1,35.2 | 21.1,35.2 21.1,34 | 21.1,34 R38.2 | C37.2 21.1,35.2 | 21.1,35.2 R32.2 | C40.2 21.1,34 | R34.2 21.1,34
N$18
  Top 0.5: LED-IN.P$1 R60.2 3.75,15.25 3.05,15.95 R58.2
N$19
  Top 0.203: R30.2 19.7,36.4 19.2,35.9 C37.1 C40.1 19.2,33.2 R37.1
N$20
  Top 0.203: C36.1 22.5,36.4 23,35.9 R32.1 R34.1 23,33.2 C41.2
N$21
  Top 0.203: C18.1 R5.2
N$22
  Top 0.203: R5.1 R11.2 29.3,39.8 29.9,39.2 C19.1 R12.2
N$23
  Top 0.203: R37.2 19.7,30.2 20,29.9 22.1,29.9 22.5,30.3 | 22.5,30.3 C41.1 | IC2.3 26.05,29.95 25.7,30.3 22.5,30.3
N$24  (via drill 0.3)
  Top 0.203: C38.1 24.1,37.2 24.2,37.1 R31.1 24.2,36.3 24.75,35.75 IC2.14 24.75,32.45 v24.2,31.9 | v26,23.9 26.4,23.5 R28.1
  Bottom 0.203: v24.2,31.9 24.2,29 23,27.8 23,23.4 23.6,22.8 25.3,22.8 26,23.5 v26,23.9
N$25
  Top 0.203: R35.2 C35.2
N$26
  Top 0.203: C39.1 25.5,37.2 25.4,37.1 R31.2 IC2.13
N$27
  Top 0.203: IC1.9 31,42.2 31.3,41.9 C23.2 R12.1
N$28
  Top 0.203: C31.2 C32.2 R23.2 R21.2
N$29
  Top 0.203: C38.2 C39.2 R36.2 R40.2
N$30
  Top 0.203: R40.1 29.1,37.7 29.6,38.2 C45.1
N$31  (via drill 0.3)
  Top 0.203: L4.2 C57.2 9.9,8.6 10.15,8.85 C55.2 | L4.2 7.55,6.85 | v6.75,6 6.75,6.1 L4.2 | R45.1 6.9,1.95 v6.75,2.1
  Bottom 0.203: v6.75,6 v6.75,2.1
N$32
  Top 0.203: Q5.1 13.05,23.75 14.4,22.4 R49.1
N$33
  Top 0.203: R47.1 C60.2 C57.1
N$34
  Top 0.203: L3.2 C56.2 9.9,3.4 10.15,3.15 C54.1
N$35
  Top 0.203: R46.1 5.95,3.9 C59.1 7.5,3.45 C56.1
N$36
  Top 0.203: R45.2 C51.1
N$37  (via drill 0.3)
  Top 0.203: R44.2 C48.1 v15,1.8 | v16.1,3.5 16.3,3.5 U4.16
  Bottom 0.203: v15,1.8 15,3.2 15.3,3.5 v16.1,3.5
N$38
  Top 0.203: R46.2 3.03,5.1 X2.1
N$39
  Top 0.203: R47.2 4.1,6.9 2.33,8.67 X2.2
N$40
  Top 0.203: IC2.8 28.65,35.65 28.7,35.7 R41.1 | R41.1 30.7,35.7 30.8,35.8 C43.1 | C45.2 R41.1
N$41
  Top 0.203: Q6.3 R57.2 5.45,21.85 5.2,22.1 R56.1
N$42
  Top 0.203: Q7.3 R64.2 5.45,18.45 5.2,18.7 R63.1
N$43
  Top 0.5: MODE.P$1 R61.2 3.75,11.85 3.05,12.55 R59.2
N$44
  Top 0.203: R62.1 11,16.5 10.55,16.95 Q7.1
N$45
  Top 0.203: Q5.3 R52.2 5.45,25.15 5.2,25.4 R51.1
N$46
  Top 0.5: R52.1 D0/TX/CLK.P$1
N$47
  Top 0.203: U3.29 28.3,17 28.5,16.8 C16.1
N$48
  Top 0.25: R8.1 15.9,47.1 | 15.9,47.1 15.9,47.8 | 15.9,47.8 Q2.3 | 16,47.9 15.9,47.8 | C21.1 17.3,47.1 15.9,47.1
N$49
  Top 0.203: IC1.4 23.4,43.5 23.1,43.8 R24.2 C34.1
N$50
  Top 0.5: D1/DATA.P$1 R57.1
N$51
  Top 0.5: CARDPRS.P$1 R64.1
N$52  (via drill 0.3)
  Top 0.203: R53.2 21.5,27.9 v21,28.4
  Bottom 0.203: v21,28.4 18.2,31.2 18.2,35.9 17.25,36.85 LED1.ANODE_RED
N$53  (via drill 0.3)
  Top 0.203: R54.1 22.9,27.7 v22.2,28.4
  Bottom 0.203: v22.2,28.4 19,31.6 19,38.1 18.3,38.8 18.3,44.3 17.46,45.14 LED1.ANODE_GRN
N$54
  Top 0.25: BZ1.- 30.07,11.23 31.4,9.9 R50.1 Q4.3
N$55
  Top 0.203: Q4.1 29.75,8.15 R48.1
N$56
  Top 0.203: R11.1 30.5,40.95 IC1.8 | IC1.8 30.85,41.55 31.7,40.7 C23.1 | IC1.8 28.05,41.55 27.4,42.2 27.4,45.1 25.9,46.6 C26.1
N$57
  Top 0.203: C42.1 30.1,31.3 | 30.1,31.3 R33.2 | IC2.4 26.7,30.9 27.1,31.3 30.1,31.3
N$58
  Top 0.203: IC1.3 26.15,44.15 26.5,44.5 26.5,45.3 25.7,46.1 25.1,46.1 24.7,46.5 R17.1
N$60
  Top 0.3: Q3.2 11.65,51.6 R10.1
N$63
  Top 0.203: R14.2 R13.1 31.7,47 C20.1 R7.2
N$64
  Top 0.203: IC1.13 30.8,44.8 31.2,44.4 C24.1 32.6,44.4 33.8,45.6 33.8,47.9 33.6,48.1 R14.1
N$65
  Top 0.254: U1.4 16.45,32.75 16.2,32.5 C3.1
N$69
  Top 0.203: C29.1 24.3,26.6 R21.1
N$71
  Top 0.203: R27.2 28.9,27.9 28.65,28.15 IC2.7 | R27.2 28.9,26.7 29.2,26.4 C31.1 | C35.1 31.4,28.4 30.3,27.3 R27.2
N$72
  Top 0.203: IC2.6 28,28.1 27.7,27.8 R27.1 27.7,26.7 27.6,26.6 C32.1
N$74
  Top 0.203: R35.1 R39.2 C44.2 C43.2
N$75
  Top 0.203: C44.1 30.8,34.4 30.7,34.5 R41.2 29.4,34.5 29.3,34.4 29.3,33.6 29.1,33.4 28.4,33.4 28,33.8 IC2.9
N$90  (via drill 0.3)
  Top 0.203: R13.2 33,46.1 32.5,45.6 C24.2 31.2,45.6 31.05,45.45 IC1.14 v29.9,46 | R18.1 v29.2,23.5
  Bottom 0.203: v29.9,46 30.1,46.2 32.3,46.2 33.9,44.6 33.9,28.8 31.5,26.4 31.5,24.9 30.1,23.5 v29.2,23.5
RESET
  Top 0.203: U3.26 29.5,14.6 | 29.5,14.6 30.6,14.6 31.2,15.2 31.2,16.56 SWD.4 | R3.1 29.5,13.6 29.5,14.6
SWDCLK
  Top 0.203: U3.31 27.9,18.6 28.2,18.9 31,18.9 SWD.3
SWDIO
  Top 0.203: U3.32 27.8,19.4 28.1,19.7 30.7,19.7 31.4,20.4 31.4,21.84 SWD.2
USART-RX  (via drill 0.3)
  Top 0.203: R61.1 D5.3 | D5.3 11.1,11.1 v11.7,10.5 | v20.5,13.6 U3.18 | D5.3 7,11.3 C64.1
  Bottom 0.203: v11.7,10.5 17.4,10.5 v20.5,13.6
V+  (via drill 0.3)
  Top 0.203: v25.5,42.85 IC1.5 23.35,42.85 23,42.5 C11.1 | v28.6,42.65 28.8,42.85 IC1.10 31.55,42.85 C10.1 | IC1.12 28.8,44.15 v28.6,44.35 | R29.2 21.1,37.7 v21.1,38.4 | R36.1 27.1,37.7 26.5,37.1 v26.5,36.7 | IC2.10 27.35,33.85 27.55,33.65 v27.55,33.1 | IC2.12 26.05,33.85 25.85,33.65 v25.85,33.1 | IC2.5 v27.35,30.45 | R23.1 26.6,26 v26.6,26.8 | R39.1 v32.6,31.1 | R16.2 v33.55,50.1 33.55,51.45 C25.1
  Top 0.4: R1.2 R2.2 C6.1 16,39.8 17.3,38.5 C7.1 | 14.3,40.3 14.5,40.5 C9.1 14.5,41.5 14.65,41.65 C12.1
  Top 0.406: R2.2 14.2,39.8 14.2,40.3 14.3,40.3
  other vias: 15.6,42.3 16.3,41.9 15.6,41.5 16.3,41.1 15.6,40.7
  pour Route4 (isolate 0.127): 34.5,56.7 27,56.7 27,46.7 22.2,46.7 22.2,42.8 15,42.8 15,36.7 18.1,36.7 18.1,25.9 34.5,25.9
  pour Top (no thermals): 14,39.4 16.1,39.4 16.1,40.2 16.7,40.8 16.7,41.9 15.7,42.9 14.3,42.9 14.3,41.7 14.2,41.6 14.2,40.5 14,40.3
VCC/2
  Top 1.7: D1.A 2.1,32.3 VCC.P$1
  pour Top (isolate 0.203, no thermals): 0.7,33.3 0.7,29.4 2.6,29.4 3.3,30.1 3.3,33.3
XIN
  Top 0.203: U3.15 12.6,14.6 12.29,14.29 QZ1.1 12.34,11.75 C13.1
XOUT
  Top 0.203: U3.16 18.25,12.94 QZ1.2 17.06,11.75 C15.1

## Text on the board
Top: AN | DN | iD | AGN
Bottom: iD | LEITOR | iD
tPlace: 1 | U3 | Control
bPlace: 125k | Control | www.controlid.com.br | Rev. 4 | RF | # | SWD | 1 | 1 | +3V3 | 2 | SWDIO | 3 | SWDCLK | 4 | !RESET | 5 | GND | 5 | MIFARE | Control
tStop: AN | DN | iD | AGN
bStop: iD | LEITOR | iD